# EAGLE schematic rfm12square (EAGLE 6.0)
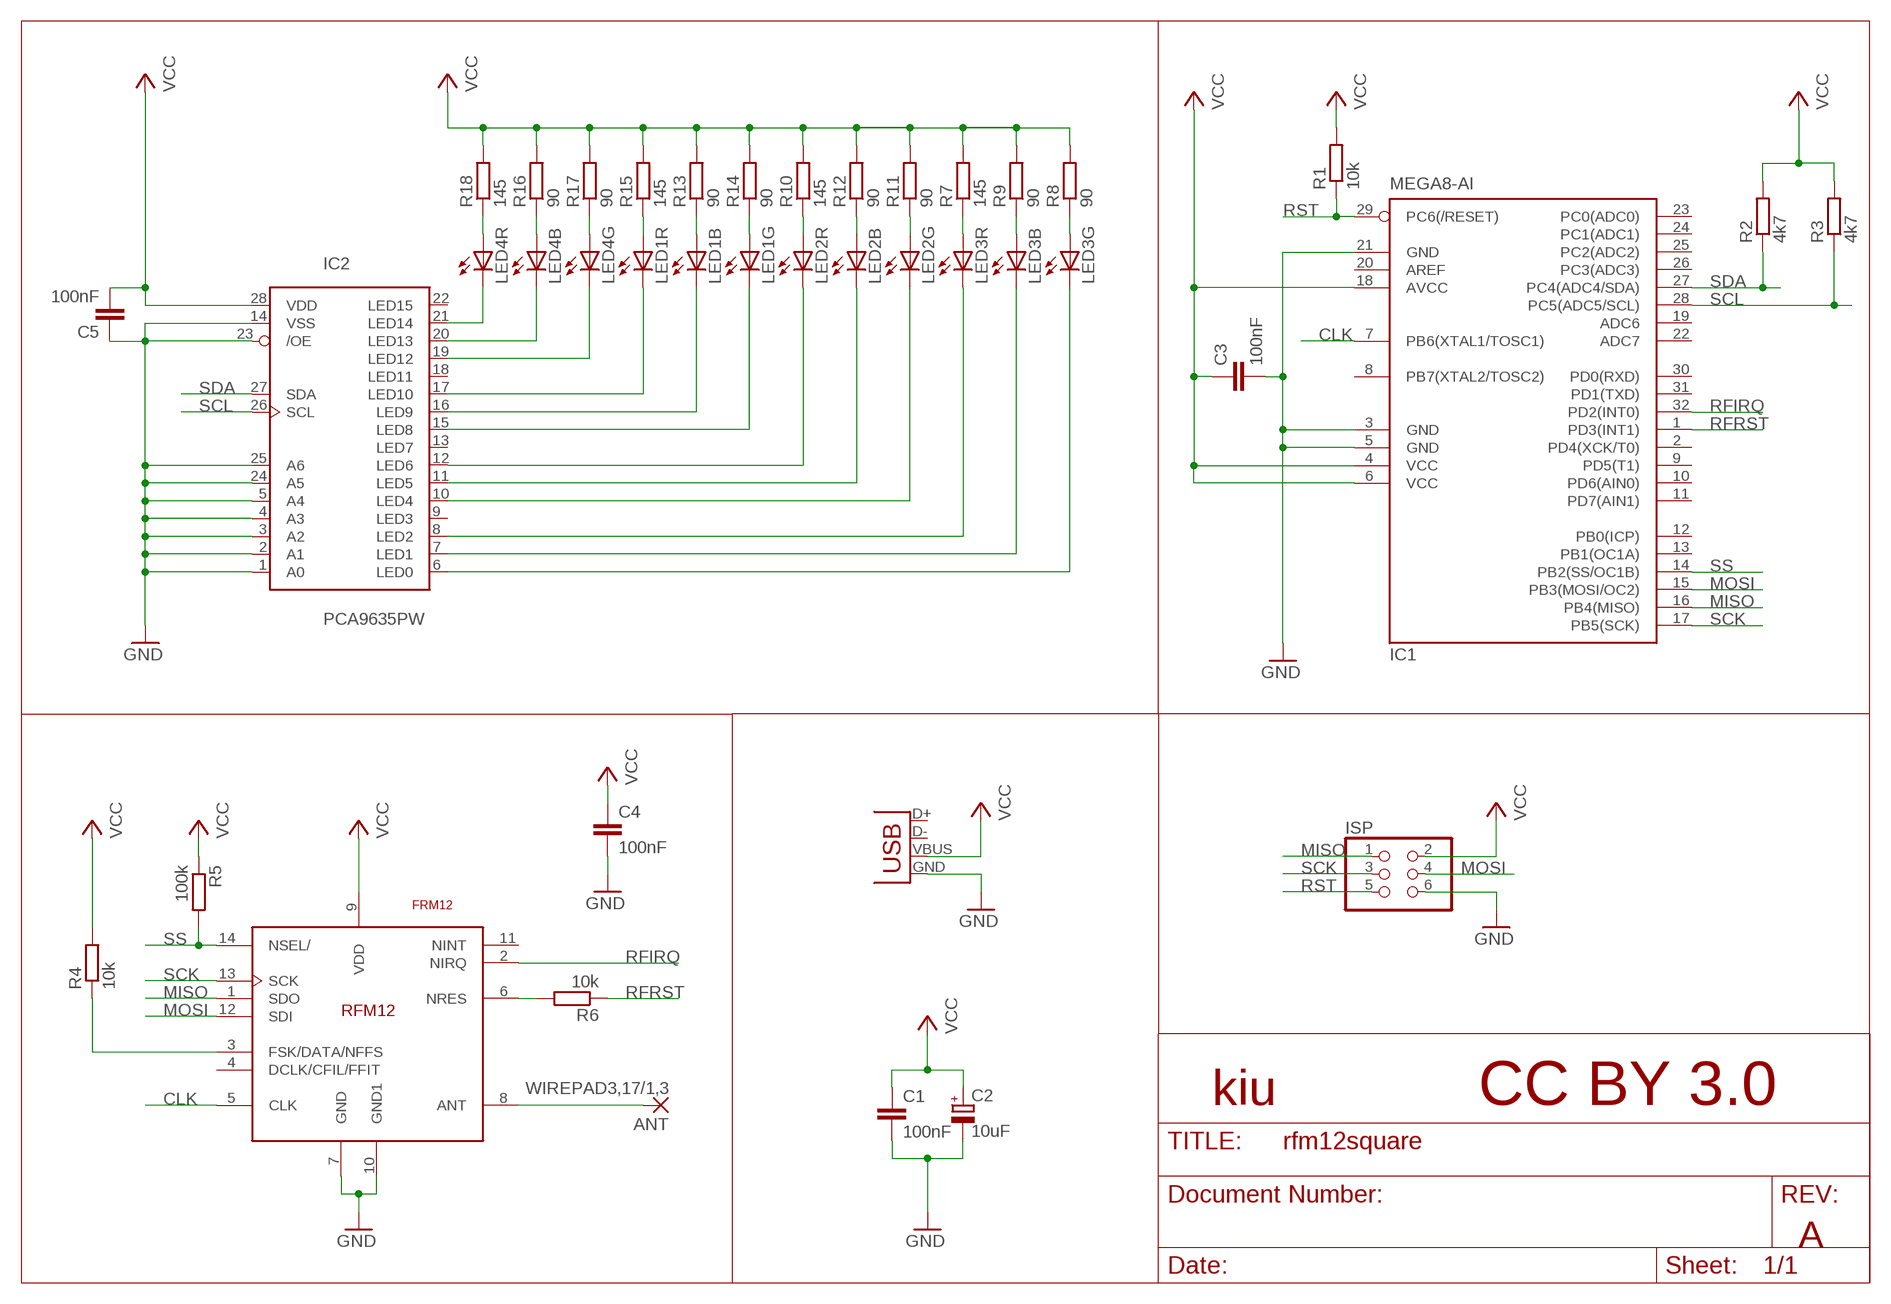
[diagram p0: schematic, sheet 1]

## Parts
ANT  WIREPAD3,17/1,3  [3,17/1,3]
C1  100nF  C-EUC0603  [C0603]
C2  10uF  CPOL-EUCT3216  [CT3216]
C3  100nF  C-EUC0603  [C0603]
C4  100nF  C-EUC0603  [C0603]
C5  100nF  C-EUC0603  [C0603]
IC1  MEGA8-AI  [TQFP32-08]
IC2  PCA9635PW  [TSSOP28]
ISP  PINHD-2X3  [2X03]
LED1  MULTILED_LRTB_G6TG  [P-LCC-6_TOPLED]
LED2  MULTILED_LRTB_G6TG  [P-LCC-6_TOPLED]
LED3  MULTILED_LRTB_G6TG  [P-LCC-6_TOPLED]
LED4  MULTILED_LRTB_G6TG  [P-LCC-6_TOPLED]
R1  10k  R-EU_R0603  [R0603]
R2  4k7  R-EU_R0603  [R0603]
R3  4k7  R-EU_R0603  [R0603]
R4  10k  R-EU_R0603  [R0603]
R5  100k  R-EU_R0603  [R0603]
R6  10k  R-EU_R0603  [R0603]
R7  145  R-EU_R0603  [R0603]
R8  90  R-EU_R0603  [R0603]
R9  90  R-EU_R0603  [R0603]
R10  145  R-EU_R0603  [R0603]
R11  90  R-EU_R0603  [R0603]
R12  90  R-EU_R0603  [R0603]
R13  90  R-EU_R0603  [R0603]
R14  90  R-EU_R0603  [R0603]
R15  145  R-EU_R0603  [R0603]
R16  90  R-EU_R0603  [R0603]
R17  90  R-EU_R0603  [R0603]
R18  145  R-EU_R0603  [R0603]
U$1  FRM12  [RFM12]
X1  USB-MICROB  [USB-MICROB]

## Nets
CLK: IC1.7(PB6(XTAL1/TOSC1)) U$1.5(CLK)
GND: C1.2 C2.- C3.2 C4.2 C5.1 IC1.3(GND) IC1.5(GND) IC1.21(GND) IC2.1(A0) IC2.2(A1) IC2.3(A2) IC2.4(A3) IC2.5(A4) IC2.14(VSS) IC2.23(/OE) IC2.24(A5) IC2.25(A6) ISP.6 U$1.7(GND) U$1.10(GND1) X1.GND
MISO: IC1.16(PB4(MISO)) ISP.1 U$1.1(SDO)
MOSI: IC1.15(PB3(MOSI/OC2)) ISP.4 U$1.12(SDI)
N$1: LED4.A2(G:A) R17.1
N$2: LED1.A2(G:A) R14.1
N$3: LED4.A3(B:A) R16.1
N$4: LED4.A1(R:A) R18.1
N$5: LED1.A3(B:A) R13.1
N$6: IC2.6(LED0) LED3.C2(G:C)
N$7: IC2.7(LED1) LED3.C3(B:C)
N$8: IC2.8(LED2) LED3.C1(R:C)
N$9: IC2.10(LED4) LED2.C2(G:C)
N$10: IC2.11(LED5) LED2.C3(B:C)
N$11: IC2.12(LED6) LED2.C1(R:C)
N$12: IC2.15(LED8) LED1.C2(G:C)
N$13: R4.1 U$1.3(FSK/DATA/NFFS)
N$14: R6.2 U$1.6(NRES)
N$15: LED1.A1(R:A) R15.1
N$16: ANT.1(P) U$1.8(ANT)
N$17: IC2.16(LED9) LED1.C3(B:C)
N$18: IC2.17(LED10) LED1.C1(R:C)
N$19: LED2.A3(B:A) R12.1
N$20: IC2.19(LED12) LED4.C2(G:C)
N$21: IC2.20(LED13) LED4.C3(B:C)
N$22: IC2.21(LED14) LED4.C1(R:C)
N$23: LED2.A2(G:A) R11.1
N$24: LED2.A1(R:A) R10.1
N$25: LED3.A1(R:A) R7.1
N$26: LED3.A3(B:A) R9.1
N$27: LED3.A2(G:A) R8.1
RFIRQ: IC1.32(PD2(INT0)) U$1.2(NIRQ)
RFRST: IC1.1(PD3(INT1)) R6.1
RST: IC1.29(PC6(/RESET)) ISP.5 R1.1
SCK: IC1.17(PB5(SCK)) ISP.3 U$1.13(SCK)
SCL: IC1.28(PC5(ADC5/SCL)) IC2.26(SCL) R3.1
SDA: IC1.27(PC4(ADC4/SDA)) IC2.27(SDA) R2.1
SS: IC1.14(PB2(SS/OC1B)) R5.2 U$1.14(NSEL/)
VCC: C1.1 C2.+ C3.1 C4.1 C5.2 IC1.4(VCC) IC1.6(VCC) IC1.18(AVCC) IC2.28(VDD) ISP.2 R1.2 R2.2 R3.2 R4.2 R5.1 R7.2 R8.2 R9.2 R10.2 R11.2 R12.2 R13.2 R14.2 R15.2 R16.2 R17.2 R18.2 U$1.9(VDD) X1.VBUS
Unconnected: IC1.2(PD4(XCK/T0)) IC1.8(PB7(XTAL2/TOSC2)) IC1.9(PD5(T1)) IC1.10(PD6(AIN0)) IC1.11(PD7(AIN1)) IC1.12(PB0(ICP)) IC1.13(PB1(OC1A)) IC1.19(ADC6) IC1.20(AREF) IC1.22(ADC7) IC1.23(PC0(ADC0)) IC1.24(PC1(ADC1)) IC1.25(PC2(ADC2)) IC1.26(PC3(ADC3)) IC1.30(PD0(RXD)) IC1.31(PD1(TXD)) IC2.9(LED3) IC2.13(LED7) IC2.18(LED11) IC2.22(LED15) U$1.4(DCLK/CFIL/FFIT) U$1.11(NINT) X1.D+ X1.D-

## Notes on the sheet
- kiu | CC BY 3.0
- A

## Library data of the parts
ANT = wirepad:WIREPAD: Wire PAD connect wire on PCB
C1 C3-C5 = rcl:C-EU: CAPACITOR, European symbol
C2 = rcl:CPOL-EU: POLARIZED CAPACITOR, European symbol
IC1 = atmel:MEGA8: MICROCONTROLLER 8 Kbytes FLASH, 1 kbytes SRAM, 512 bytes EEPROM, USART, 6-channel 10 bit ADC, 2-channel 8 bit ADC Pin compatible with Atmega48, ATMega88, ATMega168 Source: avr.lbr; MPN: ATMEGA8-16AU; OC_FARNELL: 9171371; OC_NEWARK: 73M8863
IC2 = kiu:PCA9635: PCA9635 16bit i2c
ISP = pinhead:PINHD-2X3: PIN HEADER
LED1-LED4 = led:MULTILED_LRTB_G6TG: 6-lead MULTILED® Enhanced optical Power LED (ThinFilm® / ThinGaN®) Source. OSRAM - LRTB_G6TG.pdf
R1-R18 = rcl:R-EU_: RESISTOR, European symbol
U$1 = rfm12:FRM12
X1 = SparkFun:USB: USB Connectors USB-B-PTH is fully proven SKU : PRT-00139 USB-miniB is fully proven SKU : PRT-00587 USB-A-PCB is untested. USB-A-H is throughly reviewed, but untested. Spark Fun Electronics SKU : PRT-00437 USB-B-SMT is throughly reviewed, but untested. Needs silkscreen touching up. USB-A-S has not been used/tested USB-MB-H has not been used/tested